# Altium schematic sheet 1_Power.SchDoc
size A4; SheetNumber: 1; SheetTotal: 7
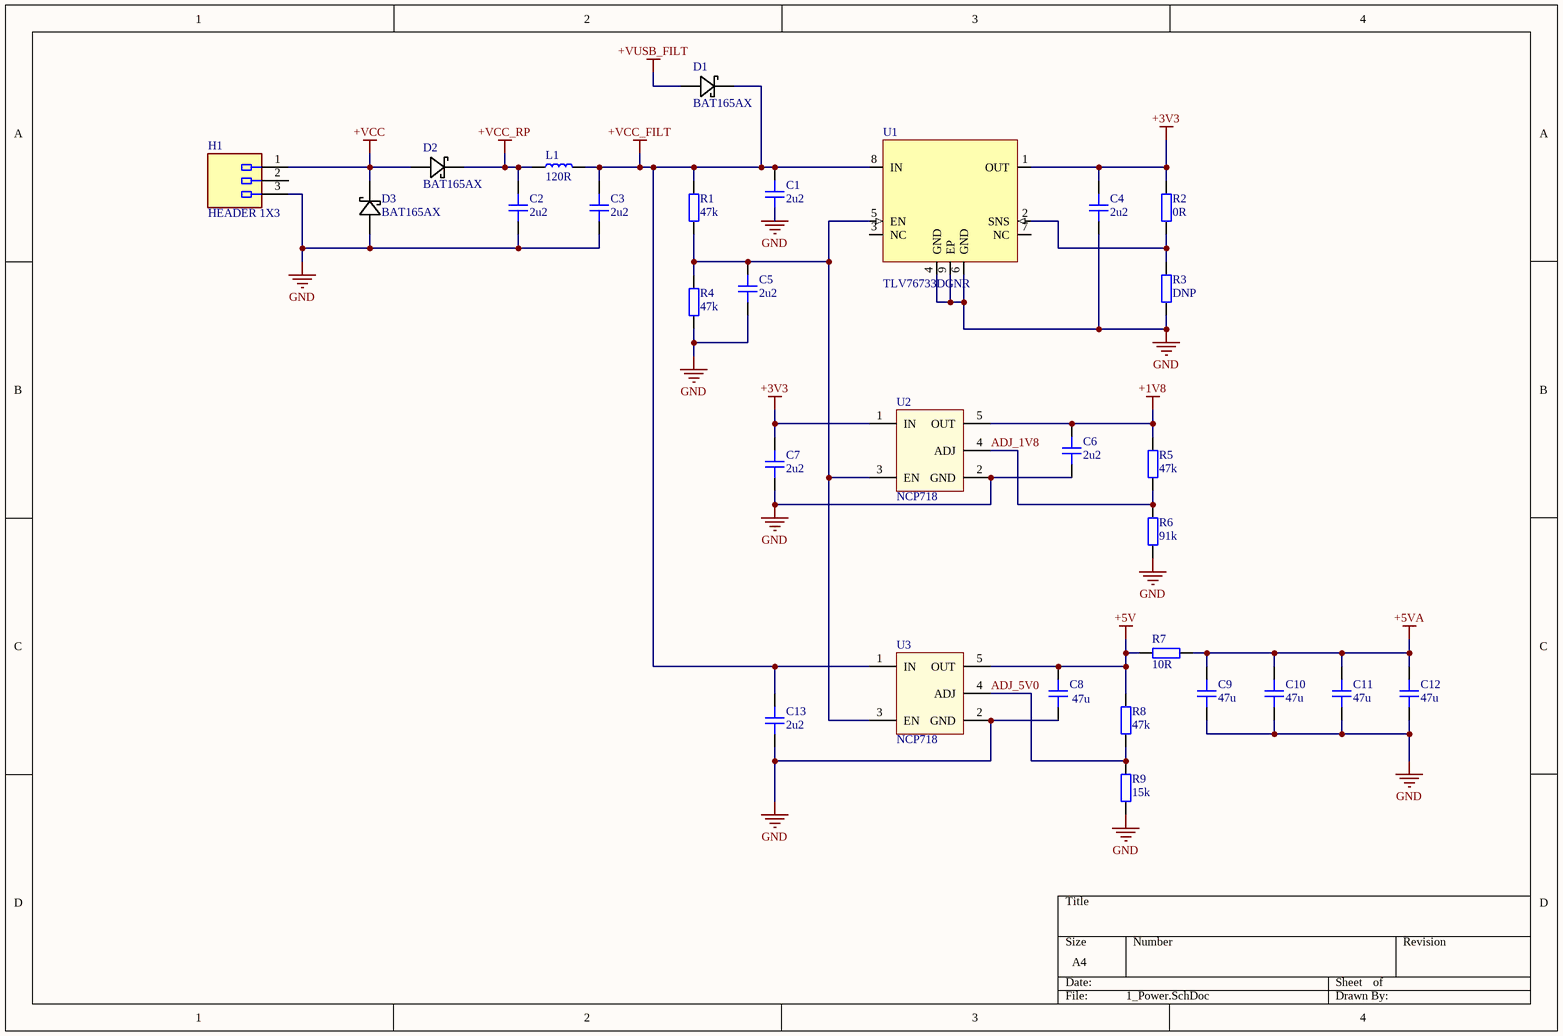
[diagram p0: 1_Power.SchDoc]

## Parts
C1  2u2  [CAP_0201]
C2  2u2  [CAP_0201]
C3  2u2  [CAP_0201]
C4  2u2  [CAP_0201]
C5  2u2  [CAP_0201]
C6  2u2  [CAP_0201]
C7  2u2  [CAP_0201]
C8  47u  [CAP_0201]
C9  47u  [CAP_0201]
C10  47u  [CAP_0201]
C11  47u  [CAP_0201]
C12  47u  [CAP_0201]
C13  2u2  [CAP_0201]
D1  BAT165AX  [BAT165AX]
D2  BAT165AX  [BAT165AX]
D3  BAT165AX  [BAT165AX]
H1  HEADER 1X3  [053048-0310]
L1  120R  [IND_1008]
R1  47k  [RES_0402]
R2  0R  [RES_0805]
R3  DNP  [RES_0805]
R4  47k  [RES_0402]
R5  47k  [RES_0402]
R6  91k  [RES_0402]
R7  10R  [RES_0402]
R8  47k  [RES_0402]
R9  15k  [RES_0402]
U1  TLV76733DGNR  [HVSSOP-8]
U2  NCP718  [NCP718]
U3  NCP718  [NCP718]

## Nets
+1V8: C6.2 R5.2 U2.5(OUT)
+3V3: C4.2 C7.2 R2.2 U1.1(OUT) U2.1(IN)
+5V: C8.2 R7.2 R8.2 U3.5(OUT)
+5VA: C9.2 C10.2 C11.2 C12.2 R7.1
+VCC: D2.2 D3.1 H1.1
+VCC_FILT: C1.2 C3.2 C13.2 D1.1 L1.2 R1.2 U1.8(IN) U3.1(IN)
+VCC_RP: C2.2 D2.1 L1.1
+VUSB_FILT: D1.2
GND: C1.1 C2.1 C3.1 C4.1 C5.1 C6.1 C7.1 C8.1 C9.1 C10.1 C11.1 C12.1 C13.1 D3.2 H1.3 R3.1 R4.1 R6.1 R9.1 U1.4(GND) U1.6(GND) U1.9(EP) U2.2(GND) U3.2(GND)
ADJ_1V8: R5.1 R6.2 U2.4(ADJ)
ADJ_5V0: R8.1 R9.2 U3.4(ADJ)
NetC5_2: C5.2 R1.1 R4.2 U1.5(EN) U2.3(EN) U3.3(EN)
NetR2_1: R2.1 R3.2 U1.2(SNS)

Not connected (* = marked no-connect by the designer): H1 2; U1 3(NC) 7(NC)

## Library data of the parts
C1-C13 = CAP_0201: Capacitor SMD 0201; Manufacturer: *; Manufacturer Part Number: *; Distributor Link: *; LCSC: *; Rating: *; Dielectric: *
H1 = 053048-0310
L1 = IND_1008: Inductor SMD 1008
R1 R4-R9 = RES_0402: Resistor SMD 0402; Manufacturer: *; Manufacturer Part Number: *; Distributor Link: *; LCSC: *
R2 R3 = RES_0805: Resistor SMD 0805; Manufacturer: *; Manufacturer Part Number: *; Distributor Link: *; LCSC: *
U1 = TLV76733DGNR: 1A 3V3 LDO Regulator HVSSOP-8; Manufacturer: Texas Instruments; Manufacturer Part Number: TLV76733DGNR; Distributor Link: https://www.mouser.de/ProductDetail/Texas-Instruments/TLV76733DGNR?qs=sGAEpiMZZMug9GoBKXZ751mAF56Mq1BpE6IEorDiG8zdSVWisnEjQA%3D%3D